# EAGLE schematic cyclops (EAGLE 6.5.0)
DESIGNER: JONATHAN P. NEWMAN; DOC_NUMBER: N/A; REVISION: 3.6

## Sheet 1 of 5: I/O Interface
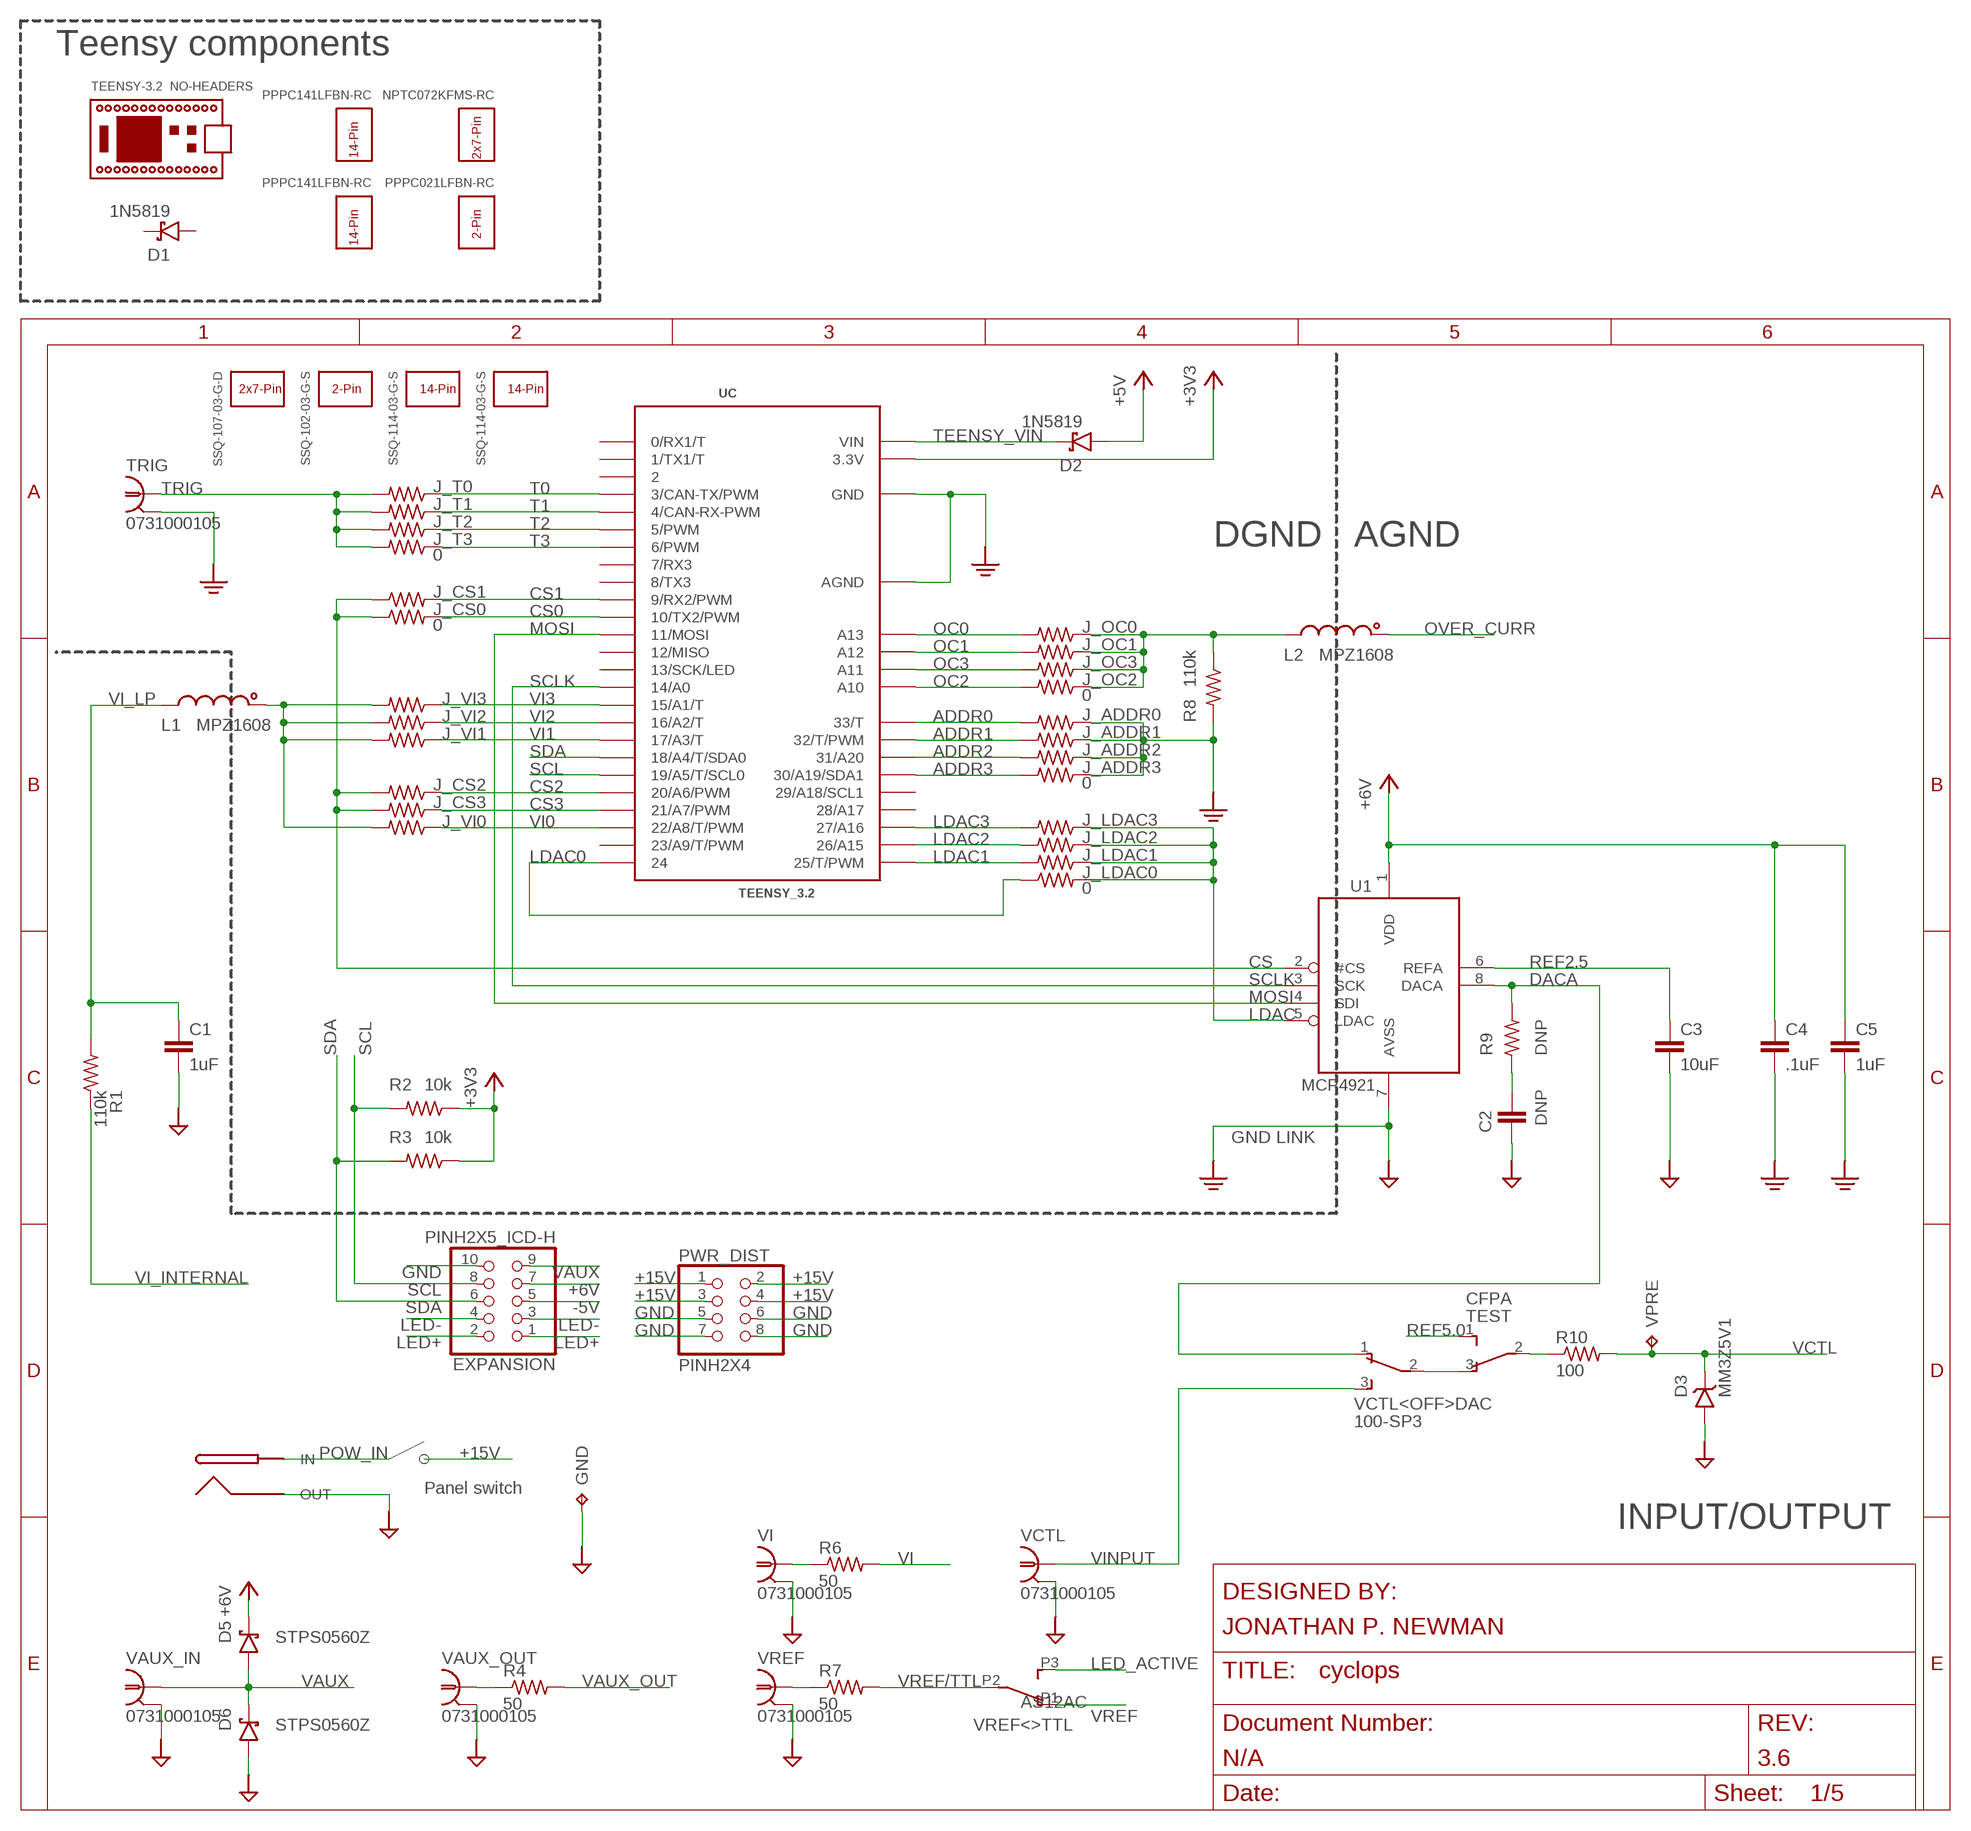
[diagram p0: schematic, sheet 1]

### Parts
C1  1uF  C_0805  [0805]
C2  C_0603  [0603]
C3  10uF  C_1206  [1206]
C4  .1uF  C_0603  [0603]
C5  1uF  C_0805  [0805]
D1  1N5819  S-DIODESOD-123  [SOD123]
D2  1N5819  S-DIODESOD-123  [SOD123]
D3  MM3Z5V1  Z-DIODE_SOD-323  [SOD-323]
D5  STPS0560Z  S-DIODESOD-123  [SOD123]
D6  STPS0560Z  S-DIODESOD-123  [SOD123]
EXPANSION  PINH2X5_ICD-H  [2X05-IDC]
GND  RCU-0C  TP_RC0603  [RC0603]
J_ADDR0  0  R_0402  [0402]
J_ADDR1  0  R_0402  [0402]
J_ADDR2  0  R_0402  [0402]
J_ADDR3  0  R_0402  [0402]
J_CS0  0  R_0402  [0402]
J_CS1  0  R_0402  [0402]
J_CS2  0  R_0402  [0402]
J_CS3  0  R_0402  [0402]
J_LDAC0  0  R_0402  [0402]
J_LDAC1  0  R_0402  [0402]
J_LDAC2  0  R_0402  [0402]
J_LDAC3  0  R_0402  [0402]
J_OC0  0  R_0402  [0402]
J_OC1  0  R_0402  [0402]
J_OC2  0  R_0402  [0402]
J_OC3  0  R_0402  [0402]
J_T0  0  R_0402  [0402]
J_T1  0  R_0402  [0402]
J_T2  0  R_0402  [0402]
J_T3  0  R_0402  [0402]
J_VI0  0  R_0402  [0402]
J_VI1  0  R_0402  [0402]
J_VI2  0  R_0402  [0402]
J_VI3  0  R_0402  [0402]
L1  MPZ1608  L_0603  [0603]
L2  MPZ1608  L_0603  [0603]
POWER  PJ-063BH  BARREL-JACK_PJ-063BH  [PJ-063BH]
PWR_DIST  PINH2X4  [2X04-BIG]
R1  110k  R_0603  [0603]
R2  10k  R_0603  [0603]
R3  10k  R_0603  [0603]
R4  50  R_1206  [1206]
R6  50  R_1206  [1206]
R7  50  R_1206  [1206]
R8  110k  R_0603  [0603]
R9  R_0603  [0603]
R10  100  R_0603  [0603]
TEST  CFPA  SPDT_CFPA  [CFPA]
TRIG  0731000105  BNC_0731000105  [0731000105]
U1  MCP4921  MCP4921SOIC  [SO08]
UC  TEENSY_3.2  TEENSY_3.1_CYCLOPS  [TEENSY_3.1_CYCLOPS]
VAUX_IN  0731000105  BNC_0731000105  [0731000105]
VAUX_OUT  0731000105  BNC_0731000105  [0731000105]
VCTL  0731000105  BNC_0731000105  [0731000105]
VCTL<OFF>DAC  100-SP3  SPDT_2M-WITHOFF  [2M1-SP1-T2-B4-M6RE]
VI  0731000105  BNC_0731000105  [0731000105]
VPRE  TPTP16R  TP_RC0603  [RC0603]
VREF  0731000105  BNC_0731000105  [0731000105]
VREF<>TTL  AS12AC  SPDT_AS12A*  [AS12A*_SPDT]

### Nets
+3V3: R2.1 R3.1 UC.3.3V UC.3.3V2(3.3V)
+5V: D2.A ; also sheet 2
+6V [pwr]: C4.1 C5.1 D5.C EXPANSION.7 U1.1(VDD) ; also sheet 2,3,4,5
+15V [pwr]: PWR_DIST.1 PWR_DIST.2 PWR_DIST.3 PWR_DIST.4 ; also sheet 2
-5V: EXPANSION.5 ; also sheet 2
ADDR0: J_ADDR0.2 UC.33(33/T)
ADDR1: J_ADDR1.2 UC.32(32/T/PWM)
ADDR2: J_ADDR2.2 UC.31(31/A20)
ADDR3: J_ADDR3.2 UC.30(30/A19/SDA1)
CS: J_CS0.1 J_CS1.1 J_CS2.2 J_CS3.2 U1.2(#CS)
CS0: J_CS0.2 UC.10(10/TX2/PWM)
CS1: J_CS1.2 UC.9(9/RX2/PWM)
CS2: J_CS2.1 UC.20/A6(20/A6/PWM)
CS3: J_CS3.1 UC.21/A7(21/A7/PWM)
DACA: R9.2 U1.8(DACA) VCTL<OFF>DAC.1
GND: C1.2 C2.2 C3.2 C4.2 C5.2 D3.A D6.A EXPANSION.10 GND.1(TP) J_ADDR0.1 J_ADDR1.1 J_ADDR2.1 J_ADDR3.1 POWER.2(OUT) PWR_DIST.5 PWR_DIST.6 PWR_DIST.7 PWR_DIST.8 R8.2 TRIG.2 TRIG.3 U1.7(AVSS) UC.AGND UC.GND UC.GND2(GND) VAUX_IN.2 VAUX_IN.3 VAUX_OUT.2 VAUX_OUT.3 VCTL.2 VCTL.3 VI.2 VI.3 VREF.2 VREF.3 ; also sheet 2,3,4,5
LDAC: J_LDAC0.2 J_LDAC1.1 J_LDAC2.1 J_LDAC3.1 U1.5(LDAC)
LDAC0: J_LDAC0.1 UC.24
LDAC1: J_LDAC1.2 UC.25(25/T/PWM)
LDAC2: J_LDAC2.2 UC.26(26/A15)
LDAC3: J_LDAC3.2 UC.27(27/A16)
LED+: EXPANSION.1 EXPANSION.2 ; also sheet 5
LED-: EXPANSION.3 EXPANSION.4 ; also sheet 5
LED_ACTIVE: VREF<>TTL.P3 ; also sheet 3
MOSI: U1.4(SDI) UC.11(11/MOSI)
N$1: C2.1 R9.1
N$14: R10.1 TEST.2
N$34: TEST.3 VCTL<OFF>DAC.2
N$52: R4.1 VAUX_OUT.1
N$54: R6.1 VI.1
N$55: R7.1 VREF.1
N$58: J_VI0.2 J_VI1.2 J_VI2.2 J_VI3.2 L1.1
OC0: J_OC0.2 UC.A13
OC1: J_OC1.2 UC.A12
OC2: J_OC2.2 UC.A10
OC3: J_OC3.2 UC.A11
OVER_CURR: L2.1 ; also sheet 5
OVER_CURR_PRE: J_OC0.1 J_OC1.1 J_OC2.1 J_OC3.1 L2.2 R8.1 ; also sheet 3
POW_IN [pwr]: POWER.1(IN)
REF2.5: C3.1 U1.6(REFA) ; also sheet 4
REF5.0: TEST.1 ; also sheet 3,4
SCL: EXPANSION.8 R2.2 UC.19/A5(19/A5/T/SCL0)
SCLK: U1.3(SCK) UC.14/A0
SDA: EXPANSION.6 R3.2 UC.18/A4(18/A4/T/SDA0)
T0: J_T0.1 UC.3(3/CAN-TX/PWM)
T1: J_T1.1 UC.4(4/CAN-RX-PWM)
T2: J_T2.1 UC.5(5/PWM)
T3: J_T3.1 UC.6(6/PWM)
TEENSY_VIN: D2.C UC.VIN
TRIG: J_T0.2 J_T1.2 J_T2.2 J_T3.2 TRIG.1
VAUX: D5.A D6.C EXPANSION.9 VAUX_IN.1 ; also sheet 5
VAUX_OUT: R4.2 ; also sheet 5
VCTL: D3.C R10.2 VPRE.1(TP) ; also sheet 5
VI: R6.2 ; also sheet 5
VI0: J_VI0.1 UC.22/A8(22/A8/T/PWM)
VI1: J_VI1.1 UC.17/A3(17/A3/T)
VI2: J_VI2.1 UC.16/A2(16/A2/T)
VI3: J_VI3.1 UC.15/A1(15/A1/T)
VI_INTERNAL: R1.1 ; also sheet 3,5
VI_LP: C1.1 L1.2 R1.2
VINPUT: VCTL.1 VCTL<OFF>DAC.3
VREF: VREF<>TTL.P1 ; also sheet 5
VREF/TTL: R7.2 VREF<>TTL.P2
Unconnected: D1.A D1.C UC.0(0/RX1/T) UC.1(1/TX1/T) UC.2 UC.7(7/RX3) UC.8(8/TX3) UC.12(12/MISO) UC.13(13/SCK/LED) UC.23/A9(23/A9/T/PWM) UC.28(28/A17) UC.29(29/A18/SCL1)

### Notes on the sheet
- Teensy components
- DGND | AGND
- DNP
- DNP
- GND LINK
- Panel switch
- INPUT/OUTPUT

## Sheet 2 of 5: Power
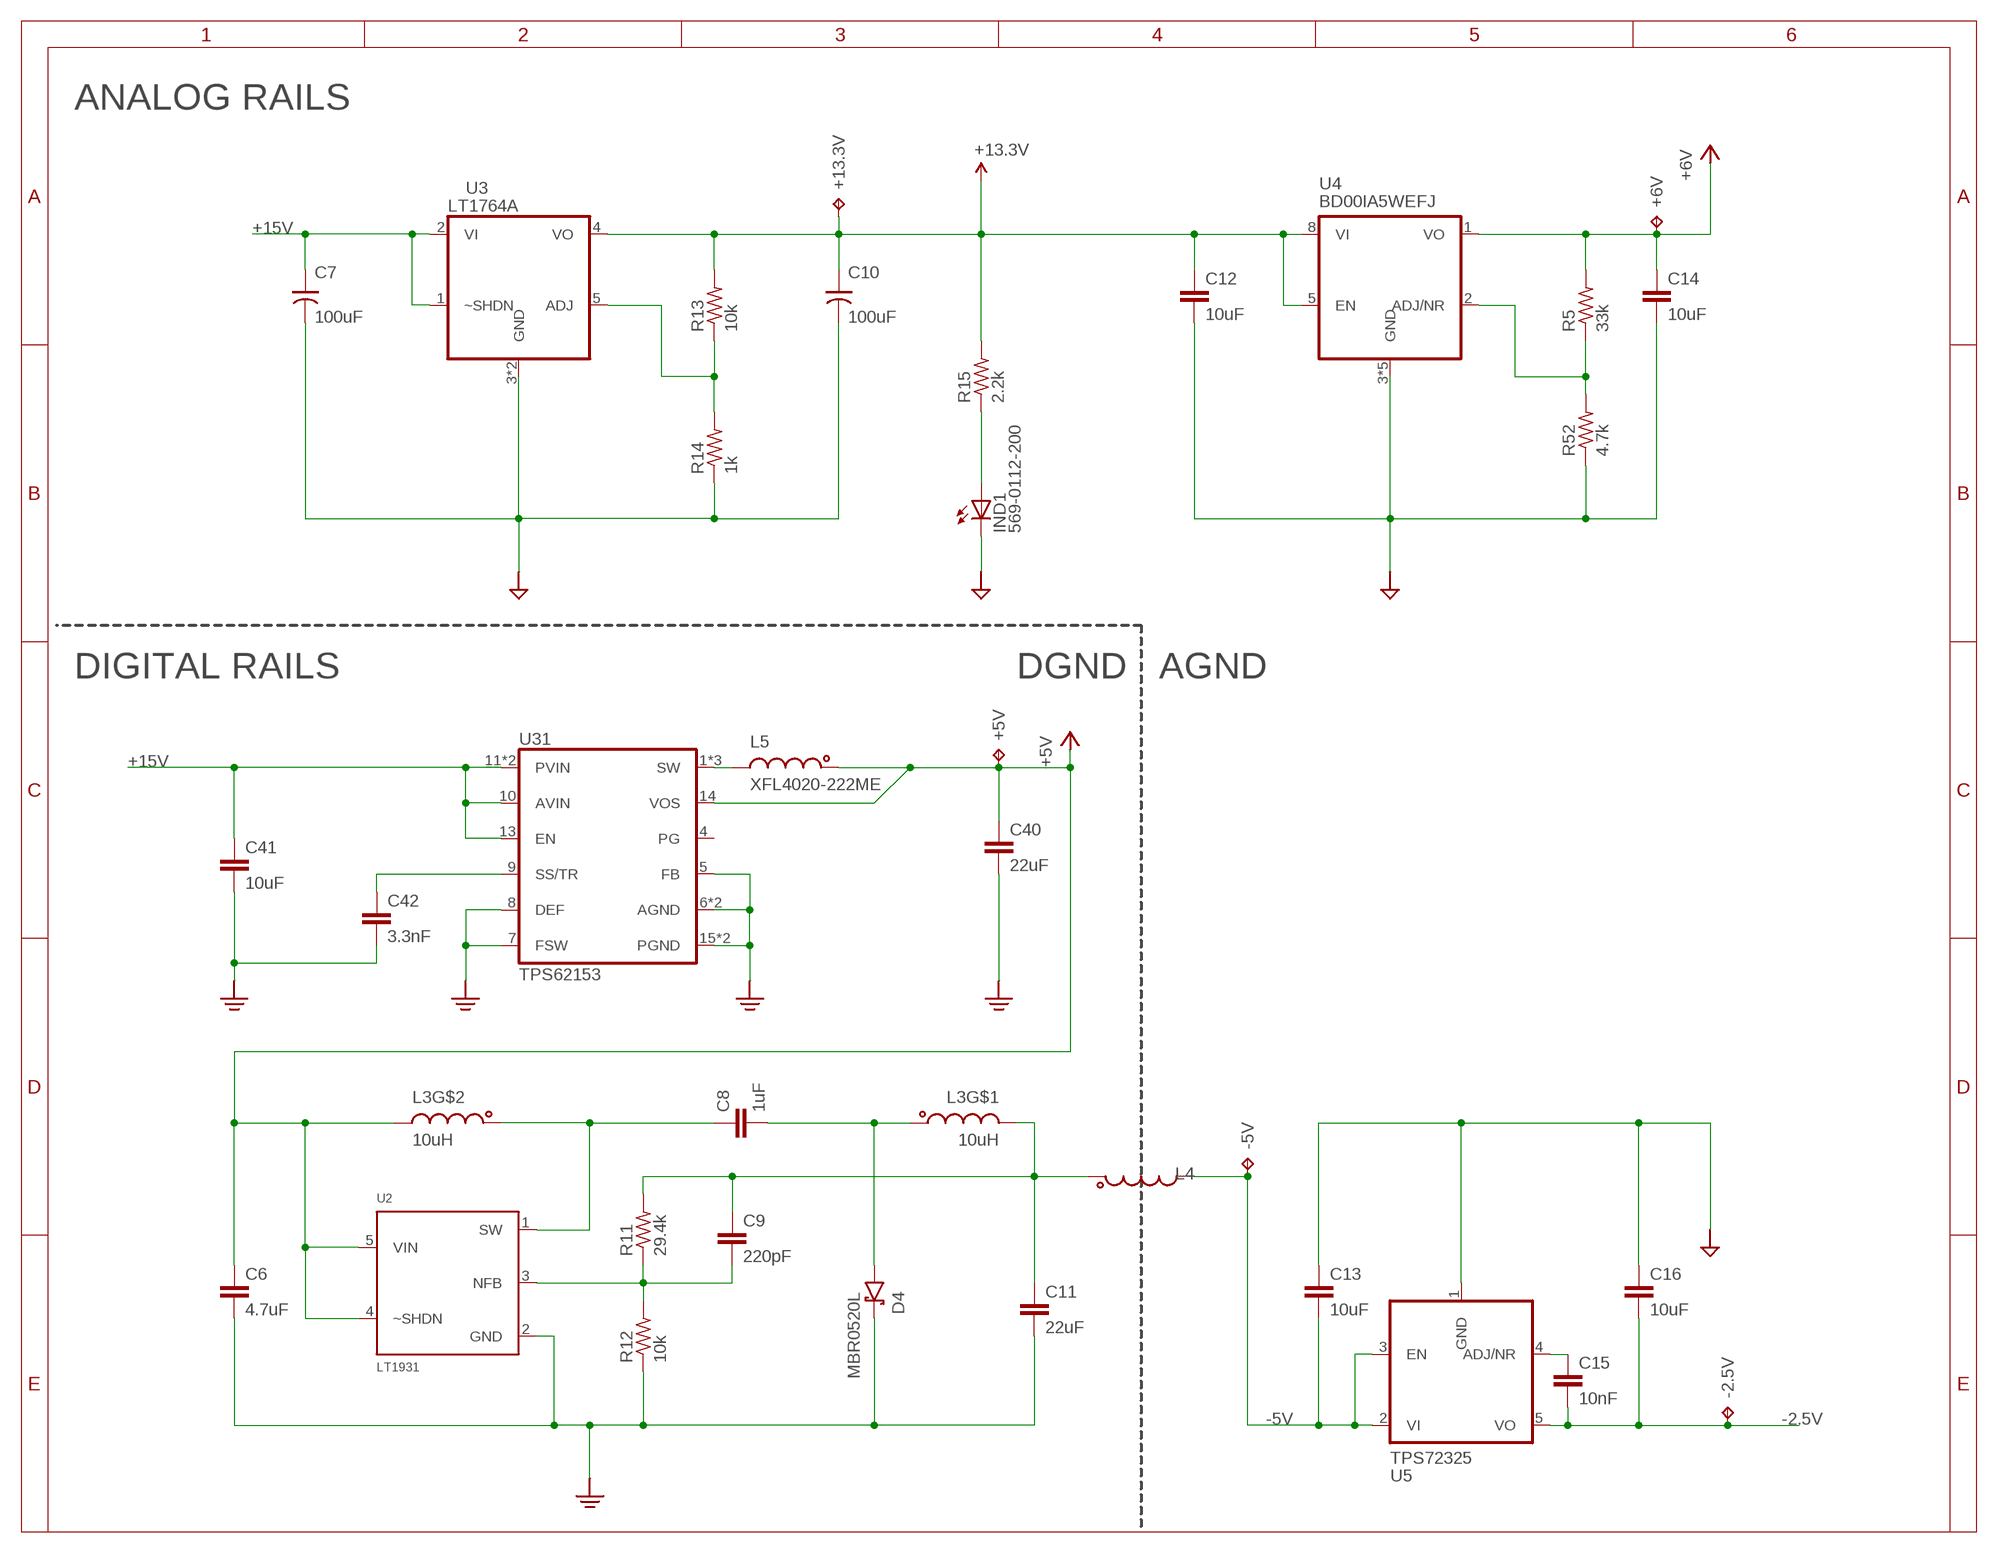
[diagram p1: schematic, sheet 2]

### Parts
+5V  RCU-0C  TP_RC0603  [RC0603]
+6V  RCU-0C  TP_RC0603  [RC0603]
+13.3V  RCU-0C  TP_RC0603  [RC0603]
-2.5V  RCU-0C  TP_RC0603  [RC0603]
-5V  RCU-0C  TP_RC0603  [RC0603]
C6  4.7uF  C_1206  [1206]
C7  100uF  C-POL_0807  [153CLV-0807]
C8  1uF  C_1206  [1206]
C9  220pF  C_0603  [0603]
C10  100uF  C-POL_0807  [153CLV-0807]
C11  22uF  C_1210  [1210]
C12  10uF  C_1206  [1206]
C13  10uF  C_1206  [1206]
C14  10uF  C_1206  [1206]
C15  10nF  C_0603  [0603]
C16  10uF  C_1206  [1206]
C40  22uF  C_1210  [1210]
C41  10uF  C_1206  [1206]
C42  3.3nF  C_0603  [0603]
D4  MBR0520L  S-DIODESOD-123  [SOD123]
IND  569-0112-200  LED_2X_VERTICAL  [569-011X-X00_LED_ARRAY]
L3  10uH  2L_CLS62  [CLS62]
L4  MPZ1608  L_0603  [0603]
L5  XFL4020-222ME  L_4020  [4020]
R5  33k  R_0603  [0603]
R11  29.4k  R_0603  [0603]
R12  10k  R_0603  [0603]
R13  10k  R_0603  [0603]
R14  1k  R_0603  [0603]
R15  2.2k  R_0603  [0603]
R52  4.7k  R_0603  [0603]
U2  LT1931  LT1611  [SOT95P310X175-5N]
U3  LT1764A  LT1963_DDPAK  [5-DDPAK]
U4  BD00IA5WEFJ  LDO_ADJUST_BDXXFC0  [SOIC127P600X175-9N]
U5  TPS72325  LDO_ADJUST_TPS72325  [SOT-23-5]
U31  TPS62153  TPS6125X_VQFN16  [VQFN16]

### Nets
+5V: +5V.1(TP) C6.1 C40.1 L3.3 L5.1 U2.4(~SHDN) U2.5(VIN) U31.14(VOS) ; also sheet 1
+6V [pwr]: +6V.1(TP) C14.1 R5.2 U4.1(VO) ; also sheet 1,3,4,5
+13.3V [pwr]: +13.3V.1(TP) C10.+ C12.1 R13.2 R15.2 U3.4(VO) U4.5(EN) U4.8(VI) ; also sheet 5
+15V [pwr]: C7.+ C41.1 U3.1(~SHDN) U3.2(VI) U31.10(AVIN) U31.11(PVIN) U31.12(PVIN) U31.13(EN) ; also sheet 1
-2.5V: -2.5V.1(TP) C15.2 C16.2 U5.5(VO) ; also sheet 3,5
-5V: -5V.1(TP) C13.2 L4.2 U5.2(VI) U5.3(EN) ; also sheet 1
GND: C6.2 C7.- C10.- C11.2 C12.2 C13.1 C14.2 C16.1 C40.2 C41.2 C42.2 D4.C IND.C1(1:C) R12.1 R14.1 R52.1 U2.2(GND) U3.3(GND) U3.TAB(GND) U4.3(GND) U4.4(GND) U4.6(GND) U4.7(GND) U4.9(GND) U5.1(GND) U31.5(FB) U31.6(AGND) U31.7(FSW) U31.8(DEF) U31.15(PGND) U31.16(PGND) U31.PAD(AGND) ; also sheet 1,3,4,5
N$3: IND.A1(1:A) R15.1
N$12: R13.1 R14.2 U3.5(ADJ)
N$32: C8.1 L3.2 U2.1(SW)
N$33: C8.2 D4.A L3.1
N$35: C9.1 C11.1 L3.4 L4.1 R11.2
N$36: C9.2 R11.1 R12.2 U2.3(NFB)
N$43: R5.1 R52.2 U4.2(ADJ/NR)
N$51: C15.1 U5.4(ADJ/NR)
N$56: C42.1 U31.9(SS/TR)
SW: L5.2 U31.1(SW) U31.2(SW) U31.3(SW)
Unconnected: U31.4(PG)

### Notes on the sheet
- ANALOG RAILS
- DIGITAL RAILS | DGND | AGND

## Sheet 3 of 5: Current Sense
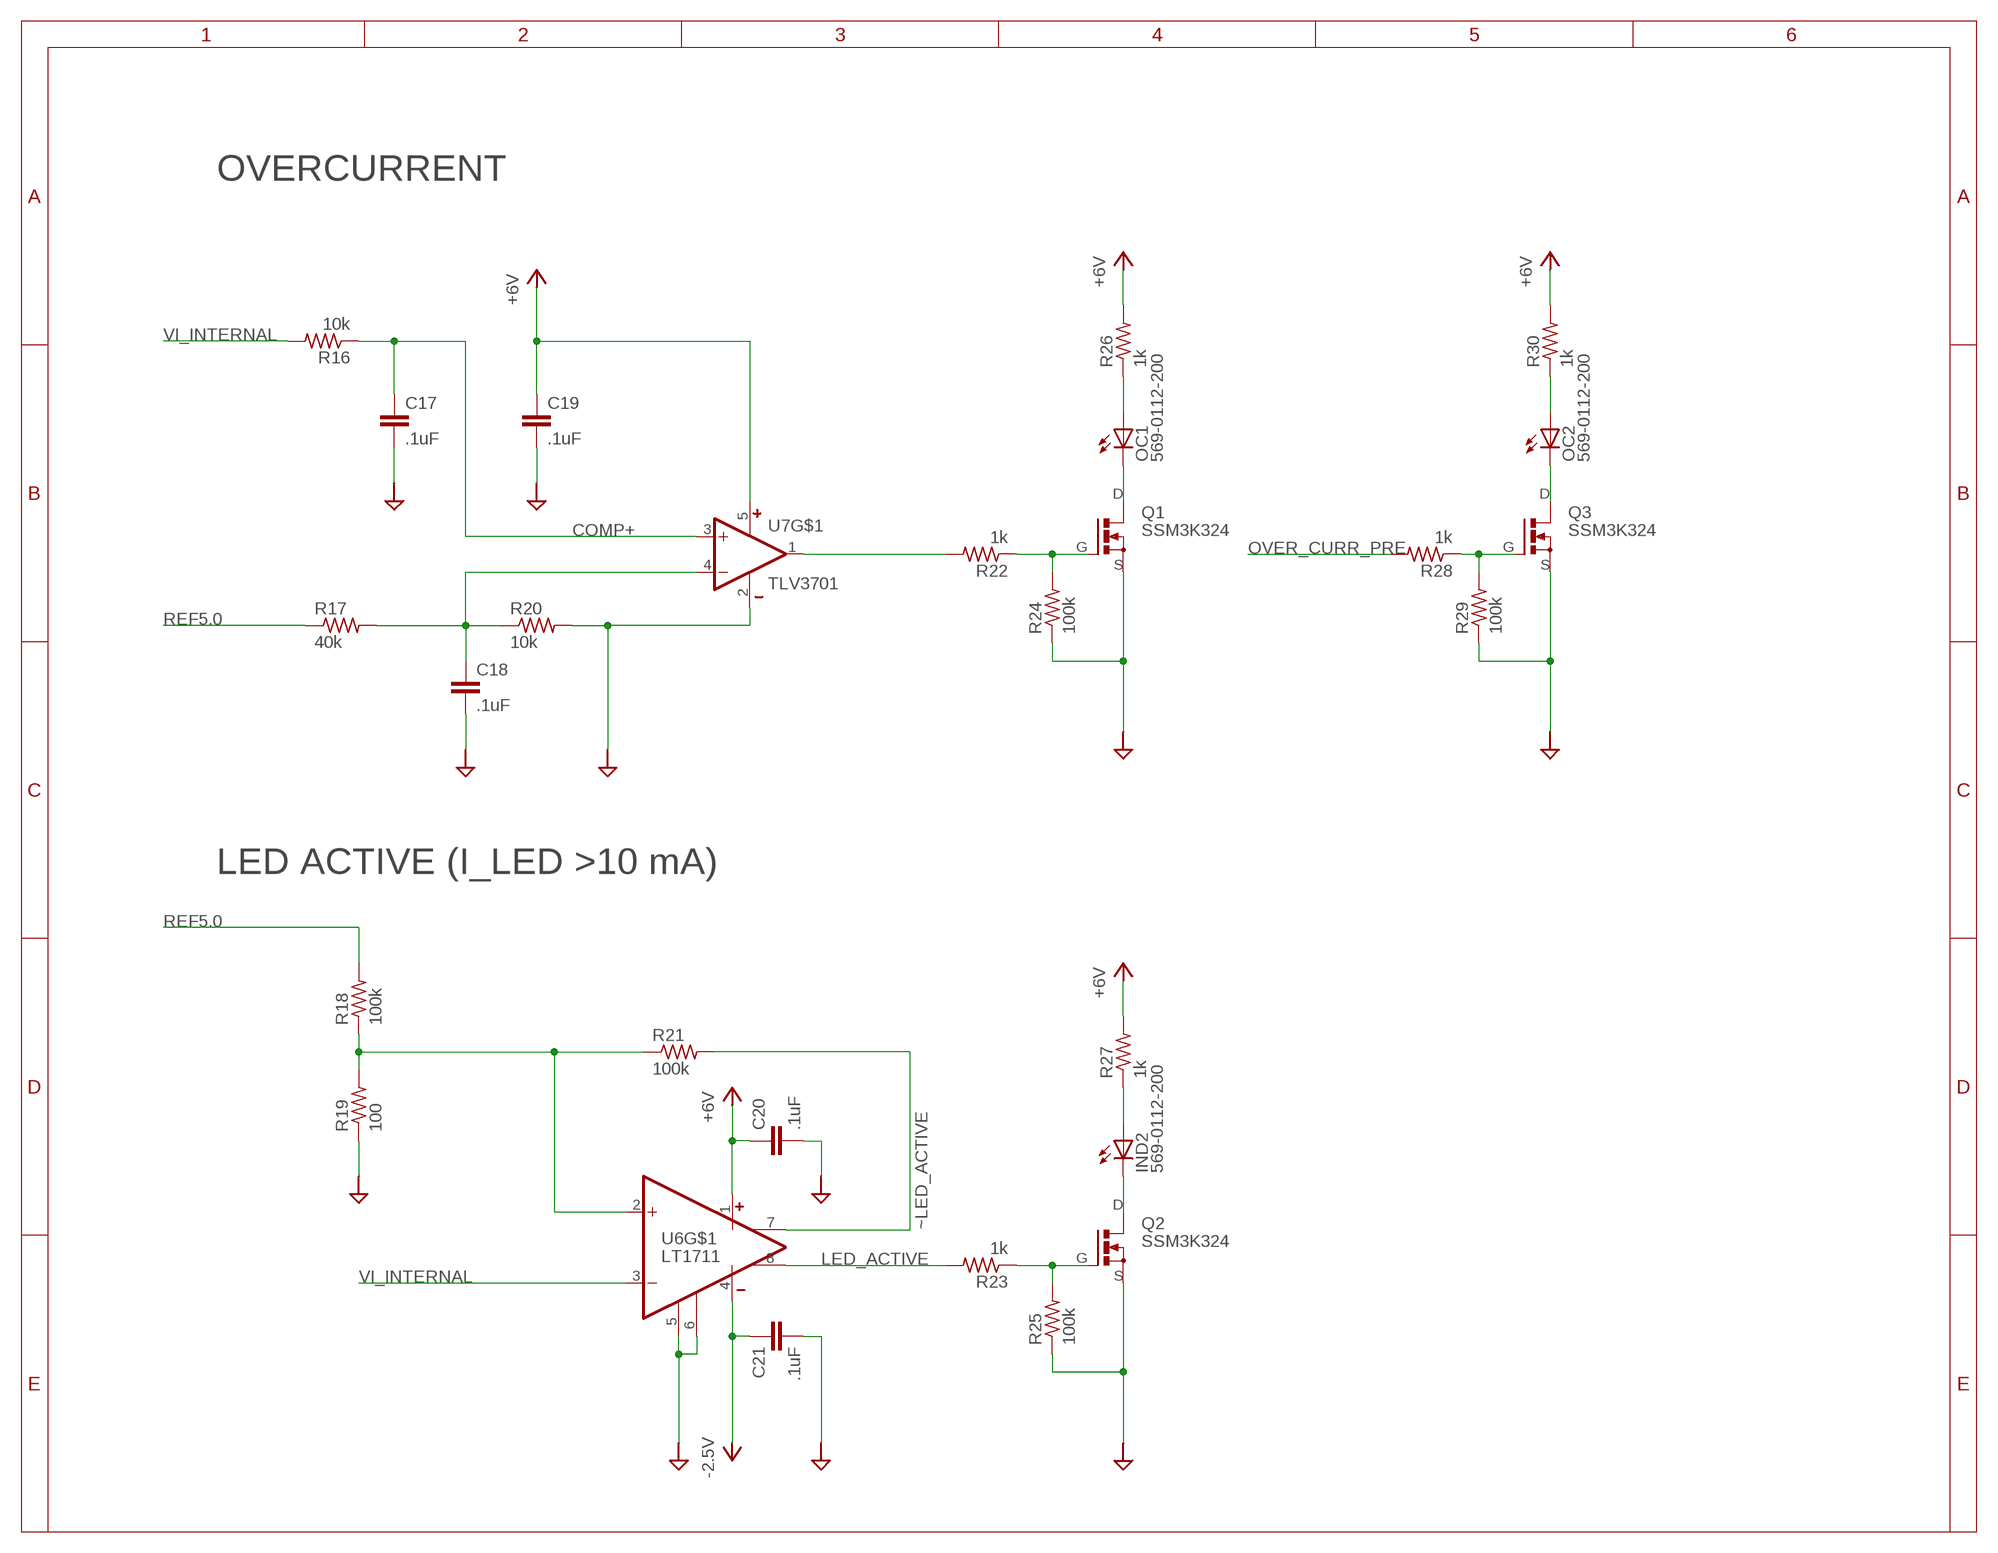
[diagram p2: schematic, sheet 3]

### Parts
C17  .1uF  C_0603  [0603]
C18  .1uF  C_0603  [0603]
C19  .1uF  C_0603  [0603]
C20  .1uF  C_0603  [0603]
C21  .1uF  C_0603  [0603]
OC  569-0112-200  LED_2X_VERTICAL  [569-011X-X00_LED_ARRAY]
Q1  SSM3K324  N-MOSFET_SOT23-GSD  [SOT23-GSD]
Q2  SSM3K324  N-MOSFET_SOT23-GSD  [SOT23-GSD]
Q3  SSM3K324  N-MOSFET_SOT23-GSD  [SOT23-GSD]
R16  10k  R_0603  [0603]
R17  40k  R_0603  [0603]
R18  100k  R_0603  [0603]
R19  100  R_0603  [0603]
R20  10k  R_0603  [0603]
R21  100k  R_0603  [0603]
R22  1k  R_0603  [0603]
R23  1k  R_0603  [0603]
R24  100k  R_0603  [0603]
R25  100k  R_0603  [0603]
R26  1k  R_0603  [0603]
R27  1k  R_0603  [0603]
R28  1k  R_0603  [0603]
R29  100k  R_0603  [0603]
R30  1k  R_0603  [0603]
U6  LT1711  [SOP65P490X110-8N]
U7  TLV3701  COMPARITOR_ADCMP600  [SOT-23-5]

### Nets
+6V [pwr]: C19.1 C20.1 R26.2 R27.2 R30.2 U6.1(V+) U7.5(V+) ; also sheet 1,2,4,5
-2.5V: C21.1 U6.4(V-) ; also sheet 2,5
COMP+: C17.1 R16.1 U7.3(+IN)
GND: C17.2 C18.2 C19.2 C20.2 C21.2 Q1.S Q2.S Q3.S R19.1 R20.2 R24.1 R25.1 R29.1 U6.5(LATCH) U6.6(GND) U7.2(V-) ; also sheet 1,2,4,5
LED_ACTIVE: R23.2 U6.8(~Q) ; also sheet 1
N$2: OC.A1(1:A) R26.1
N$5: C18.1 R17.2 R20.1 U7.4(-IN)
N$9: OC.C1(1:C) Q1.D
N$16: OC.A2(2:A) R30.1
N$27: R22.2 U7.1(OUT)
N$28: Q1.G R22.1 R24.2
N$39: Q3.G R28.1 R29.2
N$42: R18.1 R19.2 R21.1 U6.2(+IN)
N$46: IND.A2(2:A) R27.1
N$47: IND.C2(2:C) Q2.D
N$49: Q2.G R23.1 R25.2
OC: OC.C2(2:C) Q3.D
OVER_CURR_PRE: R28.2 ; also sheet 1
REF5.0: R17.1 R18.2 ; also sheet 1,4
VI_INTERNAL: R16.2 U6.3(-IN) ; also sheet 1,5
~LED_ACTIVE: R21.2 U6.7(Q)

### Notes on the sheet
- OVERCURRENT
- LED ACTIVE (I_LED >10 mA)

## Sheet 4 of 5: VREF
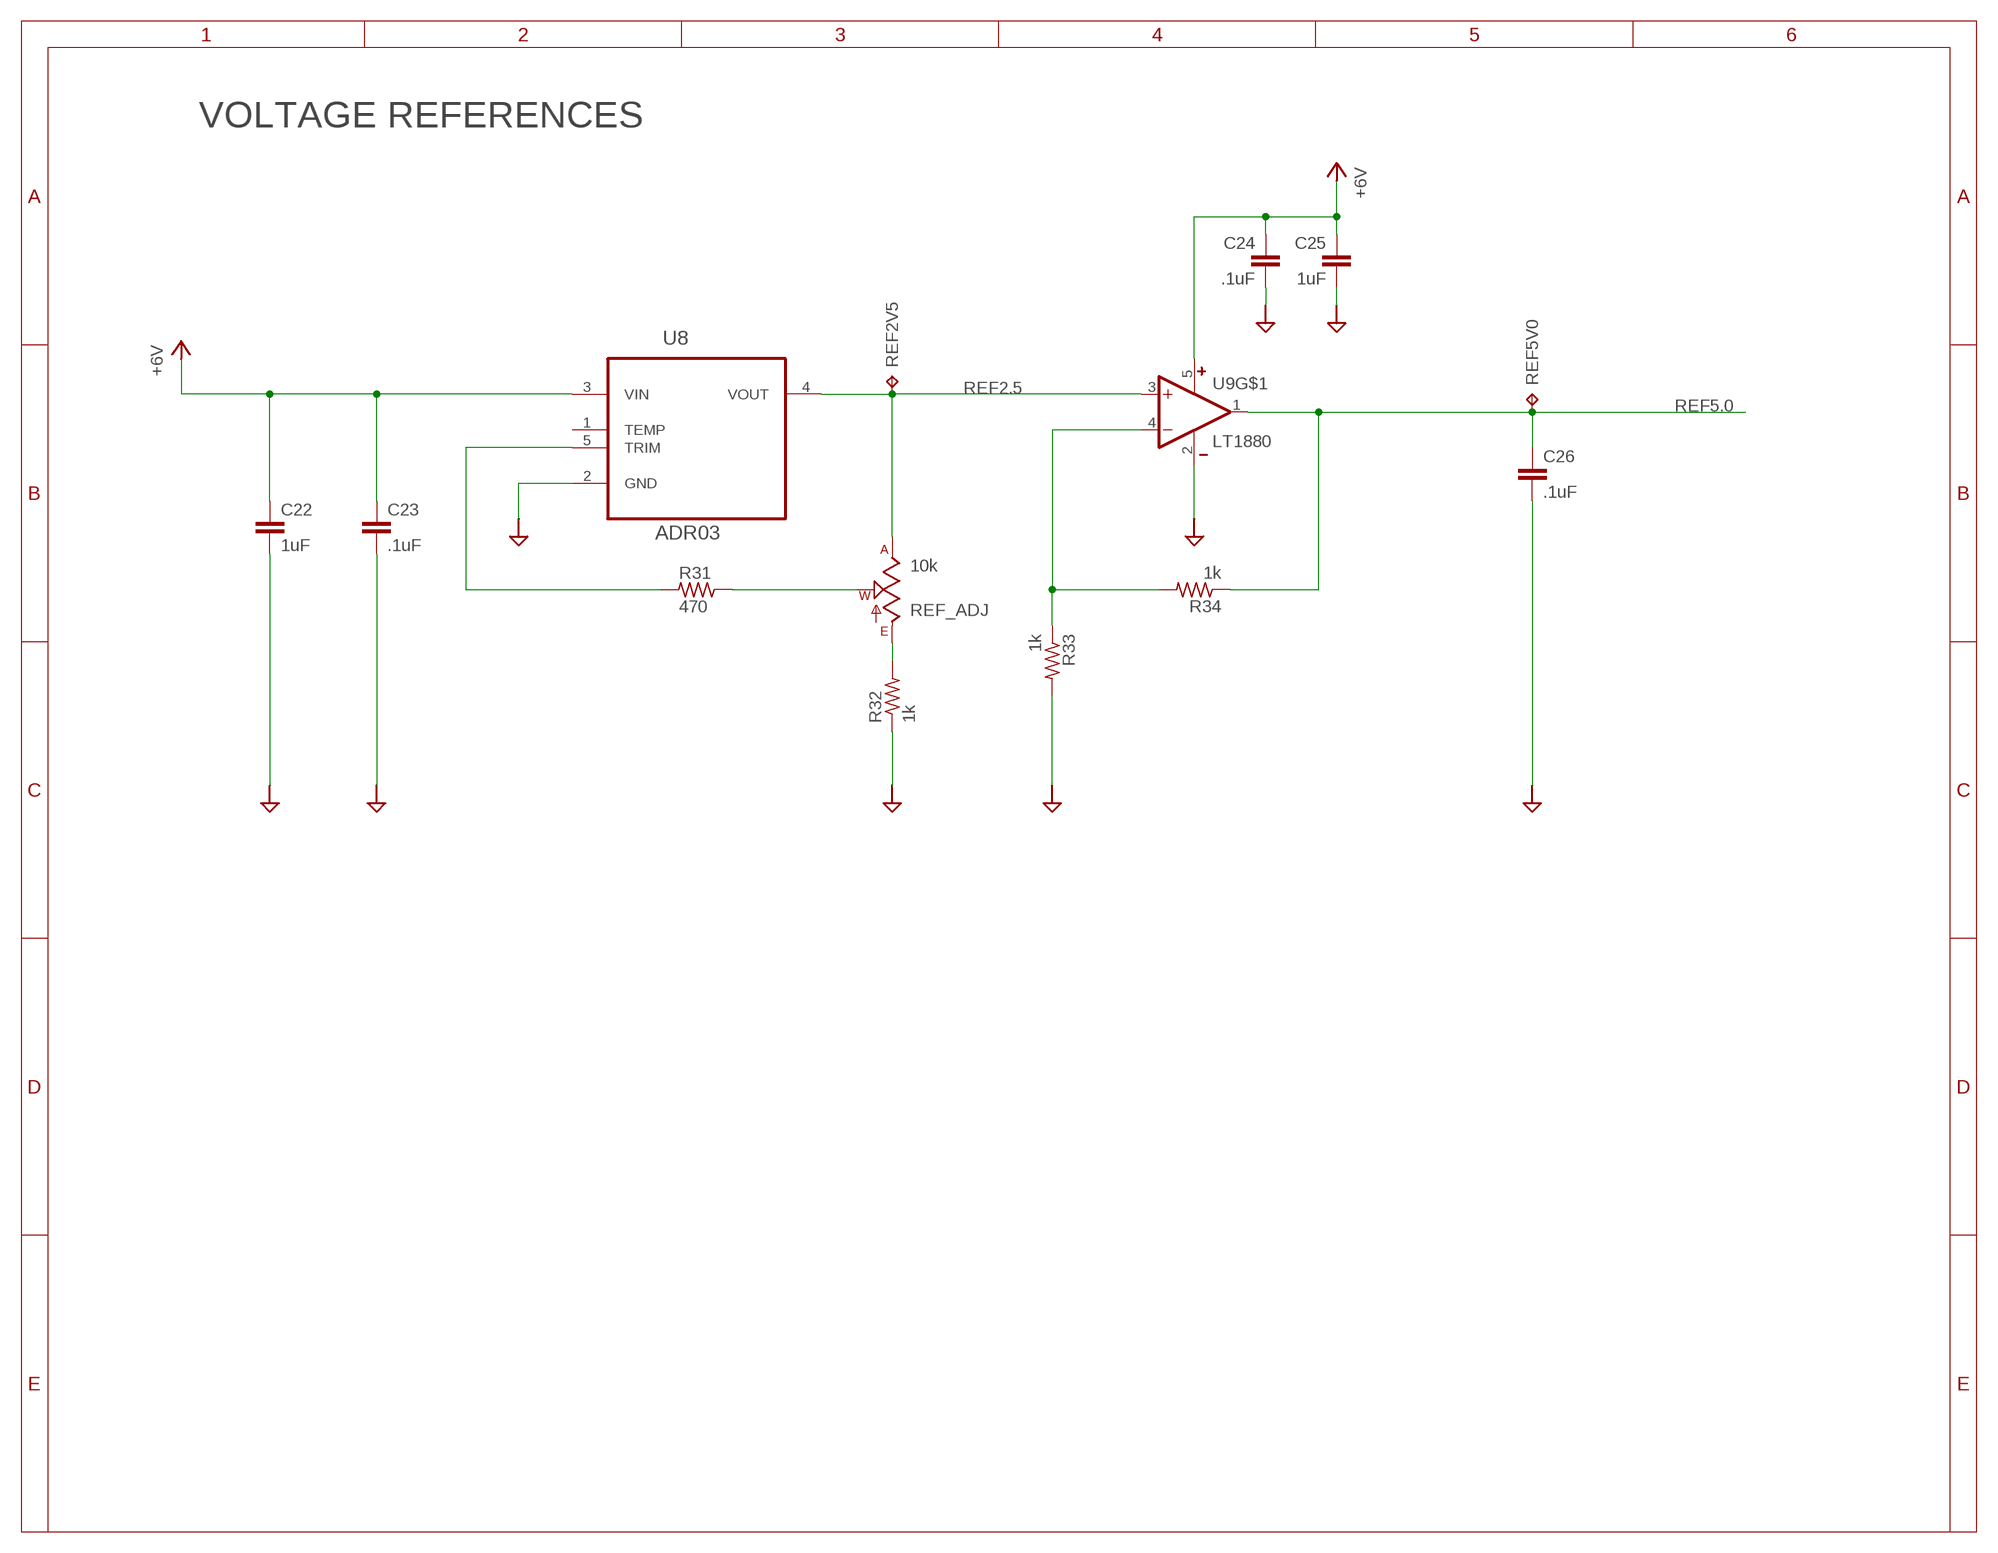
[diagram p3: schematic, sheet 4]

### Parts
C22  1uF  C_0805  [0805]
C23  .1uF  C_0603  [0603]
C24  .1uF  C_0603  [0603]
C25  1uF  C_0805  [0805]
C26  .1uF  C_0603  [0603]
R31  470  R_0603  [0603]
R32  1k  R_0603  [0603]
R33  1k  R_0603  [0603]
R34  1k  R_0603  [0603]
REF2V5  RCU-0C  TP_RC0603  [RC0603]
REF5V0  RCU-0C  TP_RC0603  [RC0603]
REF_ADJ  10k  TRIM_US-SM-42/43W  [SM-42/43W]
U8  ADR03  ADR03AKSZ-REEL7  [SOT65P210X110-5N]
U9  LT1880  OPAMP_SOT-23  [SOT95P310X175-5N]

### Nets
+6V [pwr]: C22.1 C23.1 C24.1 C25.1 U8.3(VIN) U9.5(V+) ; also sheet 1,2,3,5
GND: C22.2 C23.2 C24.2 C25.2 C26.2 R32.1 R33.2 U8.2(GND) U9.2(V-) ; also sheet 1,2,3,5
N$6: R32.2 REF_ADJ.3(E)
N$18: R33.1 R34.2 U9.4(-IN)
N$20: R31.2 U8.5(TRIM)
N$22: R31.1 REF_ADJ.2(W)
REF2.5: REF2V5.1(TP) REF_ADJ.1(A) U8.4(VOUT) U9.3(+IN) ; also sheet 1
REF5.0: C26.1 R34.1 REF5V0.1(TP) U9.1(OUT) ; also sheet 1,3
Unconnected: U8.1(TEMP)

### Notes on the sheet
- VOLTAGE REFERENCES

## Sheet 5 of 5: Driver
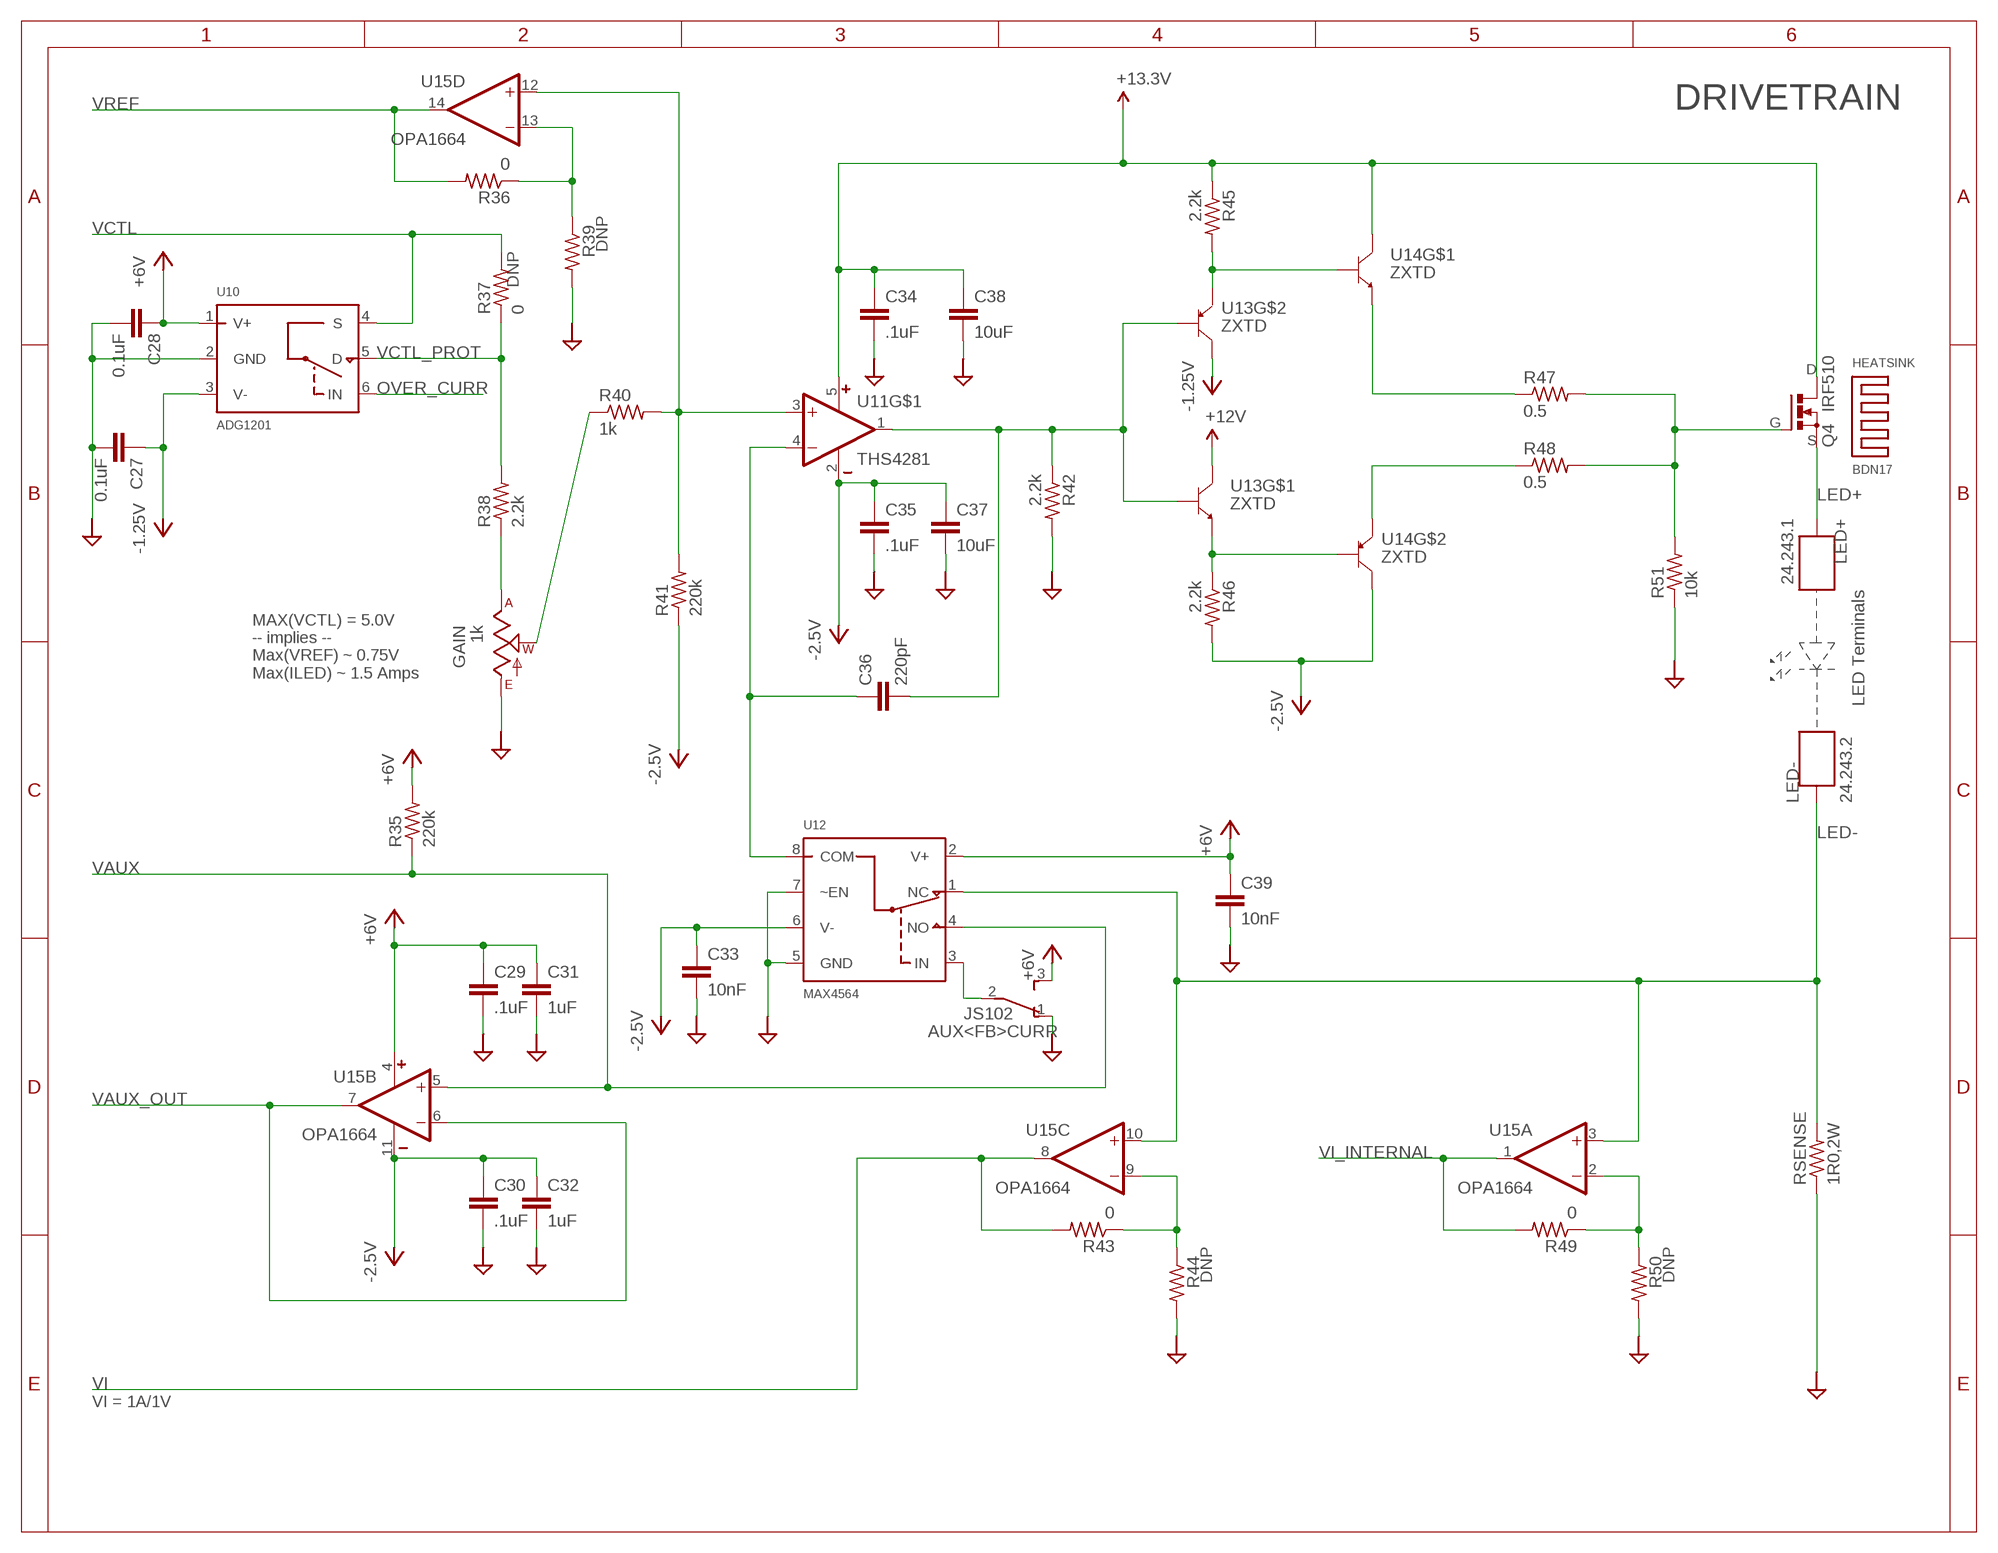
[diagram p4: schematic, sheet 5]

### Parts
AUX<FB>CURR  JS102  SPDT_JS  [JS102011SAQN]
C27  0.1uF  C_0603  [0603]
C28  0.1uF  C_0603  [0603]
C29  .1uF  C_0603  [0603]
C30  .1uF  C_0603  [0603]
C31  1uF  C_0805  [0805]
C32  1uF  C_0805  [0805]
C33  10nF  C_0603  [0603]
C34  .1uF  C_0603  [0603]
C35  .1uF  C_0603  [0603]
C36  220pF  C_0603  [0603]
C37  10uF  C_1206  [1206]
C38  10uF  C_1206  [1206]
C39  10nF  C_0603  [0603]
GAIN  1k  POT_US_3310  [3310C-001]
HEATSINK  BDN17  HEATSINK_BDN17  [BDN17]
LED+  24.243.1  BANANA_TO_BOARD_A2107  [A-2107]
LED-  24.243.2  BANANA_TO_BOARD_A2107  [A-2107]
Q4  IRF510  N-MOSFETTO-262  [TO-262_01]
R35  220k  R_0603  [0603]
R36  0  R_0603  [0603]
R37  0  R_0603  [0603]
R38  2.2k  R_0603  [0603]
R39  R_0603  [0603]
R40  1k  R_0603  [0603]
R41  220k  R_0603  [0603]
R42  2.2k  R_0603  [0603]
R43  0  R_0603  [0603]
R44  R_0603  [0603]
R45  2.2k  R_0603  [0603]
R46  2.2k  R_0603  [0603]
R47  0.5  R_0603  [0603]
R48  0.5  R_0603  [0603]
R49  0  R_0603  [0603]
R50  R_0603  [0603]
R51  10k  R_0603  [0603]
RSENSE  1R0,2W  R_2512  [2512]
U10  ADG1201  SPST_IC_SOT23-6  [SOT23-6]
U11  THS4281  OPAMP_SOT-23  [SOT95P310X175-5N]
U12  MAX4564  [SOT65P300X175-N]
U13  ZXTD  ZXTD4591E6  [SOT23-6]
U14  ZXTD  ZXTD4591E6  [SOT23-6]
U15  OPA1664  QUAD-OPAMP_14PIND  [SO14]

### Nets
+6V [pwr]: AUX<FB>CURR.3 C28.1 C29.1 C31.1 C39.1 R35.2 U10.1(V+) U12.2(V+) U15.4(P:V+) ; also sheet 1,2,3,4
+13.3V [pwr]: C34.1 C38.1 Q4.D R45.1 U11.5(V+) U13.1(C) U14.1(C) ; supply symbol labelled +12V ; also sheet 2
-2.5V: C27.1 C30.1 C32.1 C33.1 C35.1 C37.1 R41.1 R46.2 U10.3(V-) U11.2(V-) U12.6(V-) U13.3(C) U14.3(C) U15.11(P:V-) ; also sheet 2,3
_VREF: R40.2 R41.2 U11.3(+IN) U15.12(D:+IN)
COM: C36.1 U11.4(-IN) U12.8(COM)
GND: AUX<FB>CURR.1 C27.2 C28.2 C29.2 C30.2 C31.2 C32.2 C33.2 C34.2 C35.2 C37.2 C38.2 C39.2 GAIN.1(E) R39.2 R42.2 R44.2 R50.2 R51.1 RSENSE.1 U10.2(GND) U12.5(GND) U12.7(~EN) ; also sheet 1,2,3,4
IN: AUX<FB>CURR.2 U12.3(IN)
LED+: LED+.1 LED+.2 Q4.S ; also sheet 1
LED-: LED-.1 LED-.2 RSENSE.2 U12.1(NC) U15.3(A:+IN) U15.10(C:+IN) ; also sheet 1
N$4: R45.2 U13.4(E) U14.2(B)
N$8: R36.1 R39.1 U15.13(D:-IN)
N$10: R46.1 U13.6(E) U14.5(B)
N$11: R49.1 R50.1 U15.2(A:-IN)
N$13: C36.2 R42.1 U11.1(OUT) U13.2(B) U13.5(B)
N$15: R43.1 R44.1 U15.9(C:-IN)
N$24: R48.1 U14.4(E)
N$25: R47.1 U14.6(E)
N$26: Q4.G R47.2 R48.2 R51.2
N$37: GAIN.2(W) R40.1
OVER_CURR: U10.6(IN) ; also sheet 1
VAUX: R35.1 U12.4(NO) U15.5(B:+IN) ; also sheet 1
VAUX_OUT: U15.6(B:-IN) U15.7(B:OUT) ; also sheet 1
VCTL: R37.2 U10.4(S) ; also sheet 1
VCTL_PROT: R37.1 R38.2 U10.5(D)
VCTL_PROTECT: GAIN.3(A) R38.1
VI: R43.2 U15.8(C:OUT) ; also sheet 1
VI_INTERNAL: R49.2 U15.1(A:OUT) ; also sheet 1,3
VREF: R36.2 U15.14(D:OUT) ; also sheet 1

### Notes on the sheet
- DRIVETRAIN
- DNP
- DNP
- LED Terminals
- MAX(VCTL) = 5.0V
  -- implies --
  Max(VREF) ~ 0.75V
  Max(ILED) ~ 1.5 Amps
- DNP | DNP
- VI = 1A/1V

## Library data of the parts
+5V +6V +13.3V -2.5V -5V GND REF2V5 REF5V0 VPRE = jonnew:TP: Test pad
AUX<FB>CURR TEST VCTL<OFF>DAC = cyclops:SPDT: SPDT Switch
C1 C5 C22 C25 C31 C32 = cyclops:C: Capacitor; MN: TDK Corp.; PARTNO: C2012X5R1Cxxxxxxx; VID: DK
C2-C4 C6 C8 C9 C11 C17-C21 C23 C24 C26-C30 C33-C40 = cyclops:C: Capacitor
C7 C10 = cyclops:C-POL: Polarized Capacitor
C12-C16 C41 C42 = jonnew:C: Capacitor
D1 D2 D5 D6 = jonnew:S-DIODE: Schottky Diode
D3 = cyclops:Z-DIODE: Zener Diode
D4 = cyclops:S-DIODE: Schottky Diode
EXPANSION = cyclops:PINH2X5
GAIN = cyclops:POT_US
HEATSINK = jonnew:HEATSINK
IND OC = jonnew:LED_2X
J_ADDR0 J_ADDR1-J_ADDR3 J_CS0 J_CS1-J_CS3 J_LDAC0 J_LDAC1-J_LDAC3 J_OC0 J_OC1-J_OC3 J_T0 J_T1-J_T3 J_VI0 J_VI1-J_VI3 R4 R6 R7 = jonnew:R: Resistor
L1 L2 L4 = cyclops:L: Inductor
L3 = cyclops:2L
L5 = jonnew:L: Inductor
LED+ LED- = cyclops:BANANA_TO_BOARD: Female banana socket to board, right angle. Digikey part: J111-ND (or similar).
POWER = cyclops:BARREL-JACK
PWR_DIST = cyclops:PINH2X4
Q1-Q3 = jonnew:N-MOSFET: N-CHANNEL MOS FET SYMBOL
Q4 = cyclops:N-MOSFET: N-CHANNEL MOS FET SYMBOL
R1-R3 R5 R8 R9 R11-R52 = cyclops:R: Resistor; DK: PxxxxHTR-ND; MN: Panasonic; MPN: ERJ-3EKFxxxxV
R10 = jonnew:R: Resistor; DK: PxxxxHTR-ND; MN: Panasonic; MPN: ERJ-3EKFxxxxV
REF_ADJ = cyclops:TRIM_US-: POTENTIOMETER
RSENSE = cyclops:R: Resistor
TRIG VAUX_IN VAUX_OUT VCTL VI VREF = jonnew:BNC: BNC CONNECTOR M/A COM www.macom.com distributor Farnell 149-452
U1 = cyclops:MCP4921: 12-bit DAC with SPI interface Microchip Technoligies
U2 = cyclops:LT1611
U3 = cyclops:LT1963: 1.5A, Low Noise Fast Transient Response LDO Regulators
U4 U5 = jonnew:LDO_ADJUST
U6 = jonnew:LT1711
U7 = jonnew:COMPARITOR
U8 = cyclops:ADR03AKSZ-REEL7: Ultracompact, Precision 10.0 V/5.0 V/2.5 V/3.0 V Voltage References; MPN: ADR03AKSZ-REEL7; OC_FARNELL: 1838919; OC_NEWARK: 59K2675; PACKAGE: SC70-5; SUPPLIER: Analog Devices
U9 U11 = jonnew:OPAMP
U10 = jonnew:SPST_IC
U12 = cyclops:MAX4564
U13 U14 = cyclops:ZXTD4591E6: NPN/PNP Gate Driver
U15 = jonnew:QUAD-OPAMP_14PIN: OP AMP
U31 = jonnew:TPS6125X
UC = jonnew:TEENSY_3.1_CYCLOPS
VREF<>TTL = jonnew:SPDT: SPDT Switch